# EAGLE design 3w-rgb-led-connector-mk-4.0 (EAGLE 6.5.0)
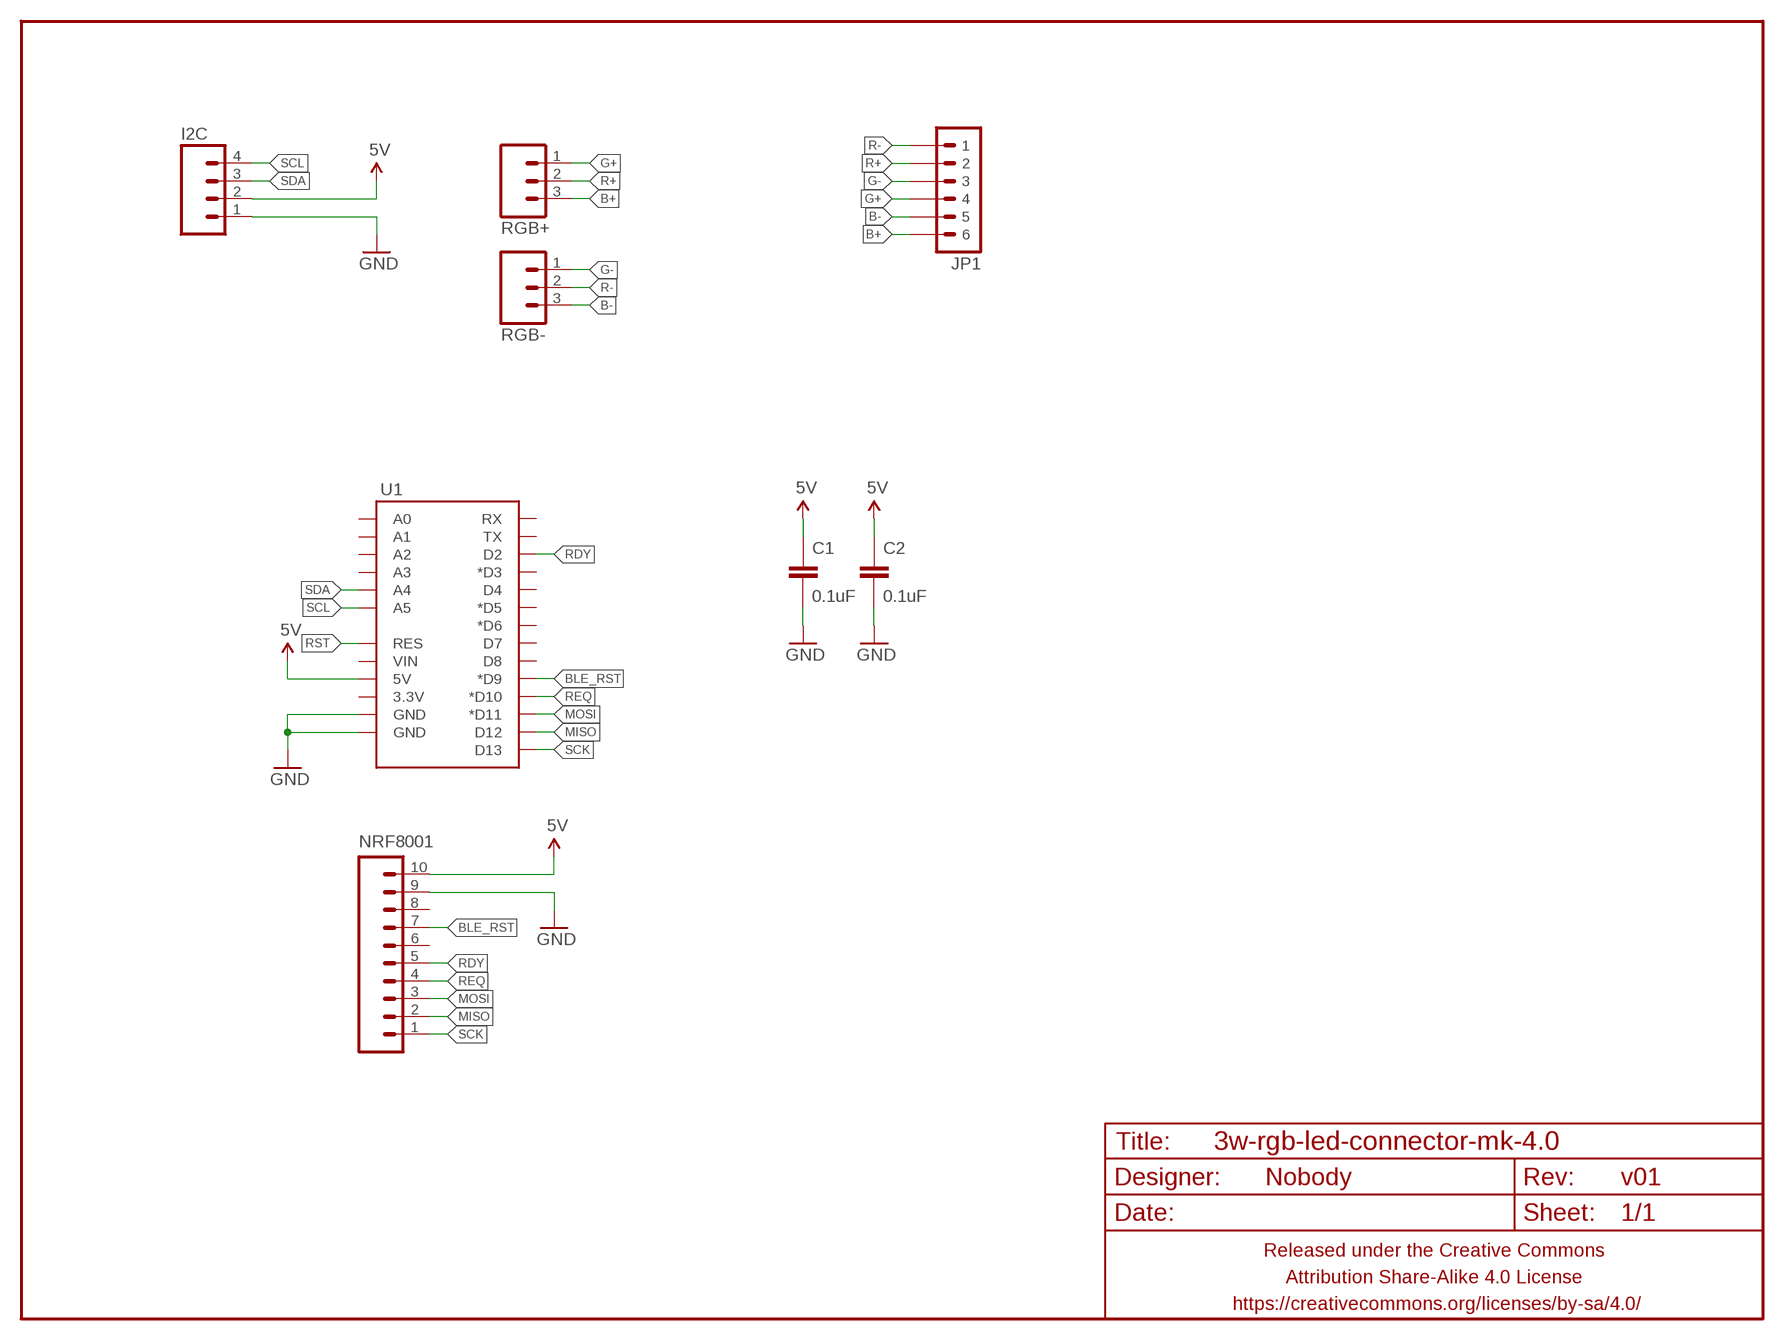
[diagram p0: schematic, sheet 1]

## Parts
C1  0.1uF  CAPACITOR-CERAMIC025-024X044  [C025-024X044]
C2  0.1uF  CAPACITOR-CERAMIC025-024X044  [C025-024X044]
FRAME1  FRAME-LETTERNO_PACKAGE  [DUMMY]
I2C  M04JST_XH_RA  [JST-4-XH-RA-PTH]
JP1  M06JST-XH-RA-PTH-LONG  [1X06-2.5MM-JST-XH-RA-LONG]
NRF8001  M10PTH-SLIM-ASS  [1X10_PTH_SLIMASS]
RGB+  M03JST-3-XH-RA-PTH-LONG  [JST-3-XH-RA-PTH-LONG]
RGB-  M03JST-3-XH-RA-PTH-LONG  [JST-3-XH-RA-PTH-LONG]
U1  ARDUINO_SHIELD_SMALLER  [ARDUINO_SHIELD_NOOUTLINE_INSIDE_SMALLER]

## Nets
5V: C1.1 C2.1 I2C.2 NRF8001.10 U1.5V
B+: JP1.6 RGB+.3
B-: JP1.5 RGB-.3
BLE_RST: NRF8001.7 U1.D9(*D9)
G+: JP1.4 RGB+.1
G-: JP1.3 RGB-.1
GND: C1.2 C2.2 I2C.1 NRF8001.9 U1.GND@0(GND) U1.GND@1(GND)
MISO: NRF8001.2 U1.D12
MOSI: NRF8001.3 U1.D11(*D11)
R+: JP1.2 RGB+.2
R-: JP1.1 RGB-.2
RDY: NRF8001.5 U1.D2
REQ: NRF8001.4 U1.D10(*D10)
RST: U1.RES
SCK: NRF8001.1 U1.D13
SCL: I2C.4 U1.A5
SDA: I2C.3 U1.A4
Unconnected: NRF8001.6 NRF8001.8 U1.3.3V U1.A0 U1.A1 U1.A2 U1.A3 U1.D3(*D3) U1.D4 U1.D5(*D5) U1.D6(*D6) U1.D7 U1.D8 U1.RX U1.TX U1.VIN

## Library data of the parts
C1 C2 = A_butts:CAPACITOR-CERAMIC: CAPACITOR, European symbol
FRAME1 = A_butts:FRAME-LETTER: Schematic Frame Standard 8.5x11 US Letter frame; DESIGNER: Nobody; VERSION: v01
I2C = A_butts:M04: Header 4 Standard 4-pin 0.1" header. Use with straight break away headers (SKU : PRT-00116), right angle break away headers (PRT-00553), swiss pins (PRT-00743), machine pins (PRT-00117), and female headers (PRT-00115). Molex polarized connector foot print use with SKU : PRT-08231 with associated crimp pins and housings. 1MM SMD Version SKU: PRT-10208
JP1 = A_butts:M06: Header 6 Standard 6-pin 0.1" header. Use with straight break away headers (SKU : PRT-00116), right angle break away headers (PRT-00553), swiss pins (PRT-00743), machine pins (PRT-00117), and female headers (PRT-00115). Molex polarized connector foot print use with SKU : PRT-08094 with associated crimp pins and housings. NOTES ON THE VARIANTS LOCK and LOCK_LONGPADS... This footprint was designed to help hold the alignment of a through-hole component (i.e. 6-pin header) while soldering it into place. You may notice that each hole has been shifted either up or down by 0.005 of an inch from it's more standard position (which is a perfectly straight line). This slight alteration caused the pins (the squares in the middle) to touch the edges of the holes. Because they are alternating, it causes a "brace" to hold the component in place. 0.005 has proven to be the perfect amount of "off-center" position when using our standard breakaway headers. Although looks a little odd when you look at the bare footprint, once you have a header in there, the alteration is very hard to notice. Also,if you push a header all the way into place, it is covered up entirely on the bottom side. This idea of altering the position of holes to aid alignment will be further integrated into the Sparkfun Library for other footprints. It can help hold any component with 3 or more connection pins.
NRF8001 = A_butts:M10: Header 10 Standard 10-pin 0.1" header. Use with straight break away headers (SKU : PRT-00116), right angle break away headers (PRT-00553), swiss pins (PRT-00743), machine pins (PRT-00117), and female headers (PRT-00115).
RGB+ RGB- = A_butts:M03: Header 3 Standard 3-pin 0.1" header. Use with straight break away headers (SKU : PRT-00116), right angle break away headers (PRT-00553), swiss pins (PRT-00743), machine pins (PRT-00117), and female headers (PRT-00115). Molex polarized connector foot print use with SKU : PRT-08232 with associated crimp pins and housings.
U1 = A_butts:ARDUINO_SHIELD_SMALLER

## Board
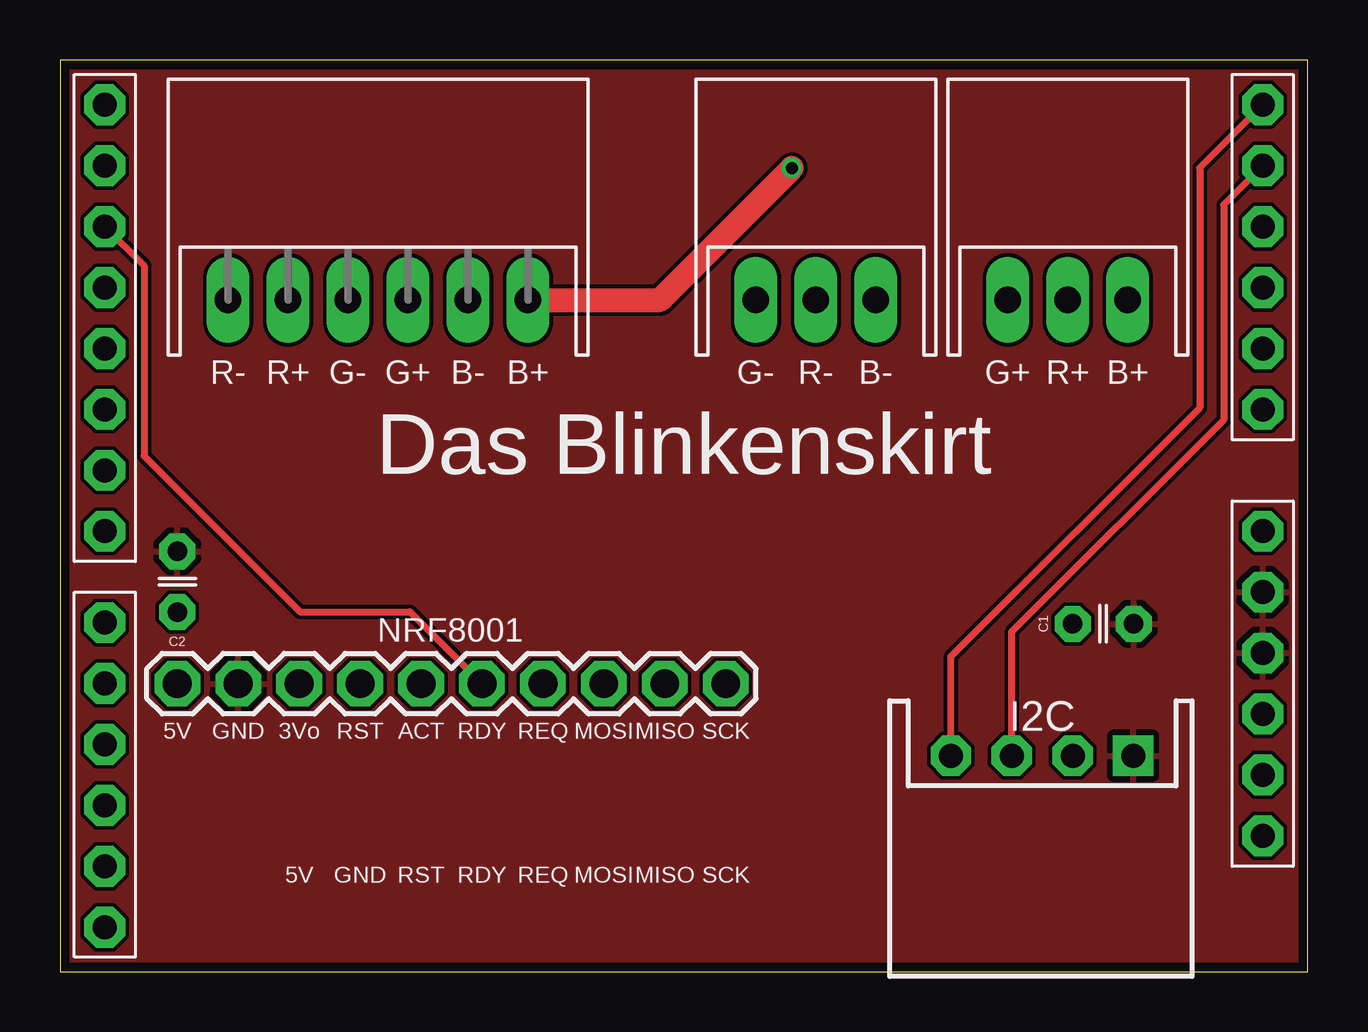
[diagram p1: board, top side]
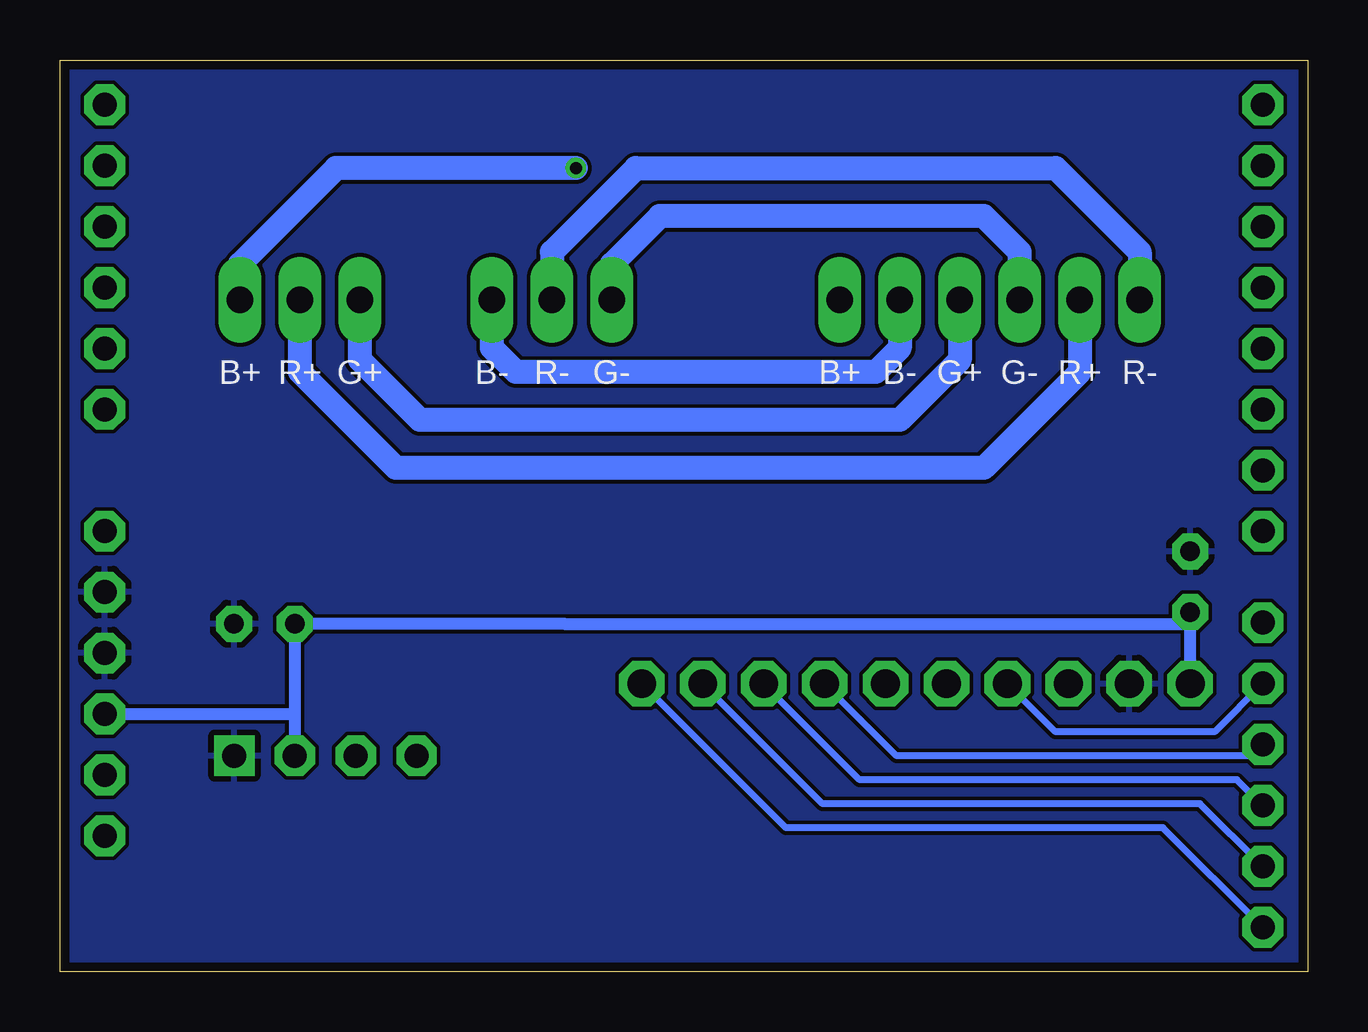
[diagram p2: board, bottom side, seen from below]

Size 52 x 38 mm. Coordinates in mm from the lower left corner, seen from the top.
Outline: 0,38 0,0 52,0 52,38 0,38
Copper layers (1*16): Top 0.0356mm / dielectric 1.5011mm / Bottom 0.0356mm
Design rules "LaenPCBOrder_2": minimum track width 6mil, minimum drill 13mil, track to track 6mil, track to pad 6mil, pad to pad 6mil, via to via 6mil, smd to smd 6mil, copper to edge 15mil, drill to drill 6mil, minimum pad ring 7mil, minimum via ring 7mil, stop-mask expansion 3mil, vias tented up to drill 20mil, thermal gap 10mil

### Footprints (pad centres in the part's own frame; a part is rotated, then mirrored left to right if it is on the bottom)
C025-024X044 = drill 0.813 pad 1.5 octagon: 1 -1.27,0; 2 1.27,0
JST-4-XH-RA-PTH = drill 1 pad 1.676 square: 1 0.02,0 | drill 1 pad 1.676 octagon: 2 2.54,0; 3 5.08,0; 4 7.62,0
1X06-2.5MM-JST-XH-RA-LONG = drill 1.1 pad 1.8 long: 1 0,0; 2 2.5,0; 3 5,0; 4 7.5,0; 5 10,0; 6 12.5,0
1X10_PTH_SLIMASS = drill 1.2 pad 1.9 octagon: 1 0,0; 2 2.54,0; 3 5.08,0; 4 7.62,0; 5 10.16,0; 6 12.7,0; 7 15.24,0; 8 17.78,0; 9 20.32,0; 10 22.86,0
JST-3-XH-RA-PTH-LONG = drill 1.1 pad 1.8 long: 1 -2.5,0; 2 0,0; 3 2.5,0
ARDUINO_SHIELD_NOOUTLINE_INSIDE_SMALLER = drill 1 pad 1.7 octagon: 3.3V 48.26,-27.94; 5V 48.26,-25.4; A0 48.26,-12.7; A1 48.26,-10.16; A2 48.26,-7.62; A3 48.26,-5.08; A4 48.26,-2.54; A5 48.26,0; D2 0,-5.08; D3 0,-7.62; D4 0,-10.16; D5 0,-12.7; D6 0,-15.24; D7 0,-17.78; D8 0,-21.59; D9 0,-24.13; D10 0,-26.67; D11 0,-29.21; D12 0,-31.75; D13 0,-34.29; GND@0 48.26,-22.86; GND@1 48.26,-20.32; RES 48.26,-30.48; RX 0,0; TX 0,-2.54; VIN 48.26,-17.78

### Placement (x,y rotation side)
C1  43.48,14.5 0 top
C2  4.89,16.25 90 top
FRAME1  0.5,0.5 0 top
I2C  44.75,9 180 top
JP1  7,28 0 top
NRF8001  27.75,12 180 top
RGB+  42,28 0 top
RGB-  31.5,28 0 top
U1  1.87,36.13 0 top

### Tracks (layer width: path | path; a pad name or v marks a point on that pad's centre or on a via)
5V
  Bottom 0.5: 4.89,14.5 30.98,14.5 C1.1 42.21,10.73 | NRF8001.10 4.89,14.5 | 4.89,14.5 C2.1 | 42.21,10.73 I2C.2 | U1.5V 42.21,10.73
B+  (via drill 0.5)
  Top 1: JP1.6 25,28 v30.5,33.5
  Bottom 1: v30.5,33.5 40.5,33.5 44.5,29.5 RGB+.3
B-
  Bottom 1: JP1.5 17,26 18,25 33,25 34,26 RGB-.3
BLE_RST
  Bottom 0.3: U1.D9 3.88,10 10.51,10 NRF8001.7
G+
  Bottom 1: JP1.4 14.5,25.5 17,23 37,23 39.5,25.5 RGB+.1
G-
  Bottom 1: JP1.3 12,30 13.5,31.5 27,31.5 29,29.5 RGB-.1
GND
  pour Top: -0.1,38.1 52.1,38.1 52.1,-0.1 -0.1,-0.1
  pour Bottom: -0.1,38.1 52.1,38.1 52.1,-0.1 -0.1,-0.1
MISO
  Bottom 0.3: U1.D12 4.49,7 20.21,7 NRF8001.2
MOSI
  Bottom 0.3: U1.D11 2.94,8 18.67,8 NRF8001.3
R+
  Bottom 1: JP1.2 9.5,25 13.5,21 38,21 42,25 RGB+.2
R-
  Bottom 1: JP1.1 7,30 10.5,33.5 28,33.5 31.5,30 RGB-.2
RDY
  Top 0.3: U1.D2 3.5,29.43 3.5,21.5 10,15 14.59,15 NRF8001.5
REQ
  Bottom 0.3: U1.D10 2.33,9 17.13,9 NRF8001.4
SCK
  Bottom 0.3: U1.D13 6.03,6 21.75,6 NRF8001.1
SCL
  Top 0.3: U1.A5 47.5,33.51 47.5,23.5 37.13,13.13 I2C.4
SDA
  Top 0.3: U1.A4 48.5,31.96 48.5,23 39.67,14.17 I2C.3

### Text on the board
tPlace: R- | R+ | G- | G+ | B- | B+ | G- | R- | B- | G+ | R+ | B+ | Das Blinkenskirt | 5V | GND | 3Vo | RST | ACT | RDY | REQ | MOSI | MISO | SCK | 5V | GND | RST | RDY | REQ | MOSI | MISO | SCK
bPlace: R- | R+ | G- | G+ | B- | B+ | G- | R- | B- | G+ | R+ | B+